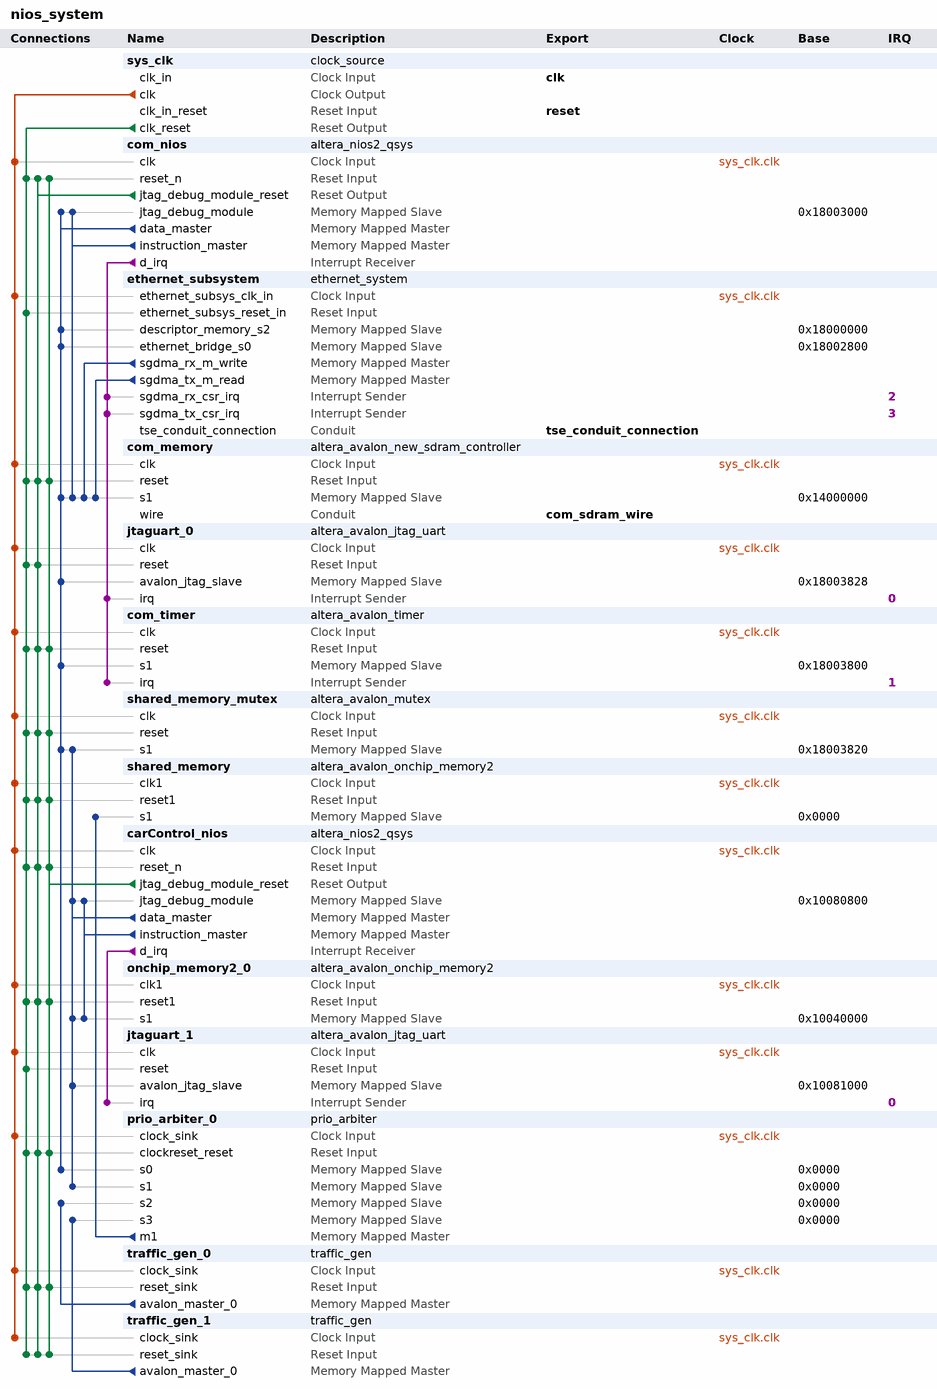
[diagram p0: system contents]
# Platform Designer (Qsys) system nios_system, Cyclone IV E EP4CE115F29C7
# Parameters at their usual value, and those the tool derives, are not listed.
package require -exact qsys 12.1
create_system nios_system
set_project_property DEVICE_FAMILY {Cyclone IV E}
set_project_property DEVICE EP4CE115F29C7

add_instance sys_clk clock_source 12.1
set_instance_parameter_value sys_clk clockFrequency 100000000

add_instance com_nios altera_nios2_qsys 12.1
set_instance_parameter_value com_nios resetOffset 20480
set_instance_parameter_value com_nios exceptionOffset 20512
set_instance_parameter_value com_nios resetSlave com_memory.s1
set_instance_parameter_value com_nios exceptionSlave com_memory.s1
set_instance_parameter_value com_nios breakSlave com_nios.jtag_debug_module
set_instance_parameter_value com_nios impl Fast
set_instance_parameter_value com_nios icache_size 4096
set_instance_parameter_value com_nios icache_burstType Sequential
set_instance_parameter_value com_nios dcache_bursts true
set_instance_parameter_value com_nios dcache_size 4096

add_instance ethernet_subsystem ethernet_system 1.0

add_instance com_memory altera_avalon_new_sdram_controller 12.1
set_instance_parameter_value com_memory TAC 5.5
set_instance_parameter_value com_memory TRCD 20.0
set_instance_parameter_value com_memory TRP 20.0
set_instance_parameter_value com_memory casLatency 3
set_instance_parameter_value com_memory columnWidth 10
set_instance_parameter_value com_memory dataWidth 32
set_instance_parameter_value com_memory generateSimulationModel false
set_instance_parameter_value com_memory model custom
set_instance_parameter_value com_memory numberOfBanks 4
set_instance_parameter_value com_memory numberOfChipSelects 1
set_instance_parameter_value com_memory powerUpDelay 200.0
set_instance_parameter_value com_memory refreshPeriod 7.8125
set_instance_parameter_value com_memory rowWidth 12

add_instance jtaguart_0 altera_avalon_jtag_uart 12.1
set_instance_parameter_value jtaguart_0 allowMultipleConnections true
set_instance_parameter_value jtaguart_0 simInteractiveOptions INTERACTIVE_ASCII_OUTPUT

add_instance com_timer altera_avalon_timer 12.1
set_instance_parameter_value com_timer alwaysRun true
set_instance_parameter_value com_timer fixedPeriod true
set_instance_parameter_value com_timer period 10
set_instance_parameter_value com_timer periodUnits MSEC
set_instance_parameter_value com_timer snapshot false
set_instance_parameter_value com_timer timerPreset SIMPLE_PERIODIC_INTERRUPT

add_instance shared_memory_mutex altera_avalon_mutex 12.1

add_instance shared_memory altera_avalon_onchip_memory2 12.1
set_instance_parameter_value shared_memory dataWidth 32
set_instance_parameter_value shared_memory dualPort false
set_instance_parameter_value shared_memory initMemContent true
set_instance_parameter_value shared_memory initializationFileName shared_memory
set_instance_parameter_value shared_memory memorySize 4096
set_instance_parameter_value shared_memory singleClockOperation true

add_instance carControl_nios altera_nios2_qsys 12.1
set_instance_parameter_value carControl_nios cpuID 65536
set_instance_parameter_value carControl_nios resetSlave onchip_memory2_0.s1
set_instance_parameter_value carControl_nios exceptionSlave onchip_memory2_0.s1
set_instance_parameter_value carControl_nios breakSlave carControl_nios.jtag_debug_module
set_instance_parameter_value carControl_nios impl Small
set_instance_parameter_value carControl_nios icache_size 4096

add_instance onchip_memory2_0 altera_avalon_onchip_memory2 12.1
set_instance_parameter_value onchip_memory2_0 dataWidth 32
set_instance_parameter_value onchip_memory2_0 dualPort false
set_instance_parameter_value onchip_memory2_0 initMemContent true
set_instance_parameter_value onchip_memory2_0 initializationFileName onchip_memory2_0
set_instance_parameter_value onchip_memory2_0 memorySize 204800

add_instance jtaguart_1 altera_avalon_jtag_uart 12.1
set_instance_parameter_value jtaguart_1 simInteractiveOptions INTERACTIVE_ASCII_OUTPUT

add_instance prio_arbiter_0 prio_arbiter 1.2
set_instance_parameter_value prio_arbiter_0 SLAVE_ADDR_WIDTH 26
set_instance_parameter_value prio_arbiter_0 DATA_WIDTH 32
set_instance_parameter_value prio_arbiter_0 MASTER_ADDR_WIDTH 28
set_instance_parameter_value prio_arbiter_0 BYTE_ENABLE_BITS 4
set_instance_parameter_value prio_arbiter_0 NUM_OF_MASTERS 4
set_instance_parameter_value prio_arbiter_0 REQUEST_QUEUE_LENGTH 24
set_instance_parameter_value prio_arbiter_0 SLOT_TIME 1

add_instance traffic_gen_0 traffic_gen 0
set_instance_parameter_value traffic_gen_0 SLAVE_ADDR_WIDTH 26
set_instance_parameter_value traffic_gen_0 DATA_WIDTH 32
set_instance_parameter_value traffic_gen_0 MASTER_ADDR_WIDTH 28
set_instance_parameter_value traffic_gen_0 BYTE_ENABLE_BITS 4
set_instance_parameter_value traffic_gen_0 BURST_COUNT_BITS 4
set_instance_parameter_value traffic_gen_0 BURST_LENGTH 8
set_instance_parameter_value traffic_gen_0 NUM_OF_MASTERS 4
set_instance_parameter_value traffic_gen_0 master_index 1
set_instance_parameter_value traffic_gen_0 sopc_enable 1

add_instance traffic_gen_1 traffic_gen 0
set_instance_parameter_value traffic_gen_1 SLAVE_ADDR_WIDTH 26
set_instance_parameter_value traffic_gen_1 DATA_WIDTH 32
set_instance_parameter_value traffic_gen_1 MASTER_ADDR_WIDTH 28
set_instance_parameter_value traffic_gen_1 BYTE_ENABLE_BITS 4
set_instance_parameter_value traffic_gen_1 BURST_COUNT_BITS 4
set_instance_parameter_value traffic_gen_1 BURST_LENGTH 8
set_instance_parameter_value traffic_gen_1 NUM_OF_MASTERS 4
set_instance_parameter_value traffic_gen_1 master_index 1
set_instance_parameter_value traffic_gen_1 sopc_enable 1

# connections
add_connection sys_clk.clk carControl_nios.clk clock
add_connection sys_clk.clk com_memory.clk clock
add_connection sys_clk.clk com_nios.clk clock
add_connection sys_clk.clk com_timer.clk clock
add_connection sys_clk.clk ethernet_subsystem.ethernet_subsys_clk_in clock
add_connection sys_clk.clk jtaguart_0.clk clock
add_connection sys_clk.clk jtaguart_1.clk clock
add_connection sys_clk.clk onchip_memory2_0.clk1 clock
add_connection sys_clk.clk prio_arbiter_0.clock_sink clock
add_connection sys_clk.clk shared_memory.clk1 clock
add_connection sys_clk.clk shared_memory_mutex.clk clock
add_connection sys_clk.clk traffic_gen_0.clock_sink clock
add_connection sys_clk.clk traffic_gen_1.clock_sink clock
add_connection carControl_nios.jtag_debug_module_reset carControl_nios.reset_n reset
add_connection carControl_nios.jtag_debug_module_reset com_memory.reset reset
add_connection carControl_nios.jtag_debug_module_reset com_nios.reset_n reset
add_connection carControl_nios.jtag_debug_module_reset com_timer.reset reset
add_connection carControl_nios.jtag_debug_module_reset onchip_memory2_0.reset1 reset
add_connection carControl_nios.jtag_debug_module_reset prio_arbiter_0.clockreset_reset reset
add_connection carControl_nios.jtag_debug_module_reset shared_memory.reset1 reset
add_connection carControl_nios.jtag_debug_module_reset shared_memory_mutex.reset reset
add_connection carControl_nios.jtag_debug_module_reset traffic_gen_0.reset_sink reset
add_connection carControl_nios.jtag_debug_module_reset traffic_gen_1.reset_sink reset
add_connection com_nios.jtag_debug_module_reset carControl_nios.reset_n reset
add_connection com_nios.jtag_debug_module_reset com_memory.reset reset
add_connection com_nios.jtag_debug_module_reset com_nios.reset_n reset
add_connection com_nios.jtag_debug_module_reset com_timer.reset reset
add_connection com_nios.jtag_debug_module_reset jtaguart_0.reset reset
add_connection com_nios.jtag_debug_module_reset onchip_memory2_0.reset1 reset
add_connection com_nios.jtag_debug_module_reset prio_arbiter_0.clockreset_reset reset
add_connection com_nios.jtag_debug_module_reset shared_memory.reset1 reset
add_connection com_nios.jtag_debug_module_reset shared_memory_mutex.reset reset
add_connection com_nios.jtag_debug_module_reset traffic_gen_0.reset_sink reset
add_connection com_nios.jtag_debug_module_reset traffic_gen_1.reset_sink reset
add_connection sys_clk.clk_reset carControl_nios.reset_n reset
add_connection sys_clk.clk_reset com_memory.reset reset
add_connection sys_clk.clk_reset com_nios.reset_n reset
add_connection sys_clk.clk_reset com_timer.reset reset
add_connection sys_clk.clk_reset ethernet_subsystem.ethernet_subsys_reset_in reset
add_connection sys_clk.clk_reset jtaguart_0.reset reset
add_connection sys_clk.clk_reset jtaguart_1.reset reset
add_connection sys_clk.clk_reset onchip_memory2_0.reset1 reset
add_connection sys_clk.clk_reset prio_arbiter_0.clockreset_reset reset
add_connection sys_clk.clk_reset shared_memory.reset1 reset
add_connection sys_clk.clk_reset shared_memory_mutex.reset reset
add_connection sys_clk.clk_reset traffic_gen_0.reset_sink reset
add_connection sys_clk.clk_reset traffic_gen_1.reset_sink reset
add_connection carControl_nios.data_master carControl_nios.jtag_debug_module avalon
set_connection_parameter_value carControl_nios.data_master/carControl_nios.jtag_debug_module baseAddress 0x10080800
add_connection carControl_nios.data_master jtaguart_1.avalon_jtag_slave avalon
set_connection_parameter_value carControl_nios.data_master/jtaguart_1.avalon_jtag_slave baseAddress 0x10081000
add_connection carControl_nios.data_master onchip_memory2_0.s1 avalon
set_connection_parameter_value carControl_nios.data_master/onchip_memory2_0.s1 baseAddress 0x10040000
add_connection carControl_nios.data_master prio_arbiter_0.s1 avalon
set_connection_parameter_value carControl_nios.data_master/prio_arbiter_0.s1 baseAddress 0x0000
add_connection carControl_nios.data_master shared_memory_mutex.s1 avalon
set_connection_parameter_value carControl_nios.data_master/shared_memory_mutex.s1 baseAddress 0x18003820
add_connection carControl_nios.instruction_master carControl_nios.jtag_debug_module avalon
set_connection_parameter_value carControl_nios.instruction_master/carControl_nios.jtag_debug_module baseAddress 0x10080800
add_connection carControl_nios.instruction_master onchip_memory2_0.s1 avalon
set_connection_parameter_value carControl_nios.instruction_master/onchip_memory2_0.s1 baseAddress 0x10040000
add_connection com_nios.data_master com_memory.s1 avalon
set_connection_parameter_value com_nios.data_master/com_memory.s1 baseAddress 0x14000000
add_connection com_nios.data_master com_nios.jtag_debug_module avalon
set_connection_parameter_value com_nios.data_master/com_nios.jtag_debug_module baseAddress 0x18003000
add_connection com_nios.data_master com_timer.s1 avalon
set_connection_parameter_value com_nios.data_master/com_timer.s1 baseAddress 0x18003800
add_connection com_nios.data_master ethernet_subsystem.descriptor_memory_s2 avalon
set_connection_parameter_value com_nios.data_master/ethernet_subsystem.descriptor_memory_s2 baseAddress 0x18000000
add_connection com_nios.data_master ethernet_subsystem.ethernet_bridge_s0 avalon
set_connection_parameter_value com_nios.data_master/ethernet_subsystem.ethernet_bridge_s0 baseAddress 0x18002800
add_connection com_nios.data_master jtaguart_0.avalon_jtag_slave avalon
set_connection_parameter_value com_nios.data_master/jtaguart_0.avalon_jtag_slave baseAddress 0x18003828
add_connection com_nios.data_master prio_arbiter_0.s0 avalon
set_connection_parameter_value com_nios.data_master/prio_arbiter_0.s0 baseAddress 0x0000
add_connection com_nios.data_master shared_memory_mutex.s1 avalon
set_connection_parameter_value com_nios.data_master/shared_memory_mutex.s1 baseAddress 0x18003820
add_connection com_nios.instruction_master com_memory.s1 avalon
set_connection_parameter_value com_nios.instruction_master/com_memory.s1 baseAddress 0x14000000
add_connection com_nios.instruction_master com_nios.jtag_debug_module avalon
set_connection_parameter_value com_nios.instruction_master/com_nios.jtag_debug_module baseAddress 0x18003000
add_connection ethernet_subsystem.sgdma_rx_m_write com_memory.s1 avalon
set_connection_parameter_value ethernet_subsystem.sgdma_rx_m_write/com_memory.s1 baseAddress 0x14000000
add_connection ethernet_subsystem.sgdma_tx_m_read com_memory.s1 avalon
set_connection_parameter_value ethernet_subsystem.sgdma_tx_m_read/com_memory.s1 baseAddress 0x14000000
add_connection prio_arbiter_0.m1 shared_memory.s1 avalon
set_connection_parameter_value prio_arbiter_0.m1/shared_memory.s1 baseAddress 0x0000
add_connection traffic_gen_0.avalon_master_0 prio_arbiter_0.s2 avalon
set_connection_parameter_value traffic_gen_0.avalon_master_0/prio_arbiter_0.s2 baseAddress 0x0000
add_connection traffic_gen_1.avalon_master_0 prio_arbiter_0.s3 avalon
set_connection_parameter_value traffic_gen_1.avalon_master_0/prio_arbiter_0.s3 baseAddress 0x0000
add_connection carControl_nios.d_irq jtaguart_1.irq interrupt
set_connection_parameter_value carControl_nios.d_irq/jtaguart_1.irq irqNumber 0
add_connection com_nios.d_irq com_timer.irq interrupt
set_connection_parameter_value com_nios.d_irq/com_timer.irq irqNumber 1
add_connection com_nios.d_irq ethernet_subsystem.sgdma_rx_csr_irq interrupt
set_connection_parameter_value com_nios.d_irq/ethernet_subsystem.sgdma_rx_csr_irq irqNumber 2
add_connection com_nios.d_irq ethernet_subsystem.sgdma_tx_csr_irq interrupt
set_connection_parameter_value com_nios.d_irq/ethernet_subsystem.sgdma_tx_csr_irq irqNumber 3
add_connection com_nios.d_irq jtaguart_0.irq interrupt
set_connection_parameter_value com_nios.d_irq/jtaguart_0.irq irqNumber 0

# exported interfaces
add_interface clk clock sink
set_interface_property clk EXPORT_OF sys_clk.clk_in
add_interface reset reset sink
set_interface_property reset EXPORT_OF sys_clk.clk_in_reset
add_interface com_sdram_wire conduit end
set_interface_property com_sdram_wire EXPORT_OF com_memory.wire
add_interface tse_conduit_connection conduit end
set_interface_property tse_conduit_connection EXPORT_OF ethernet_subsystem.tse_conduit_connection

save_system nios_system.qsys
